# EAGLE schematic NTC_MUX8_board (EAGLE 9.6.2)
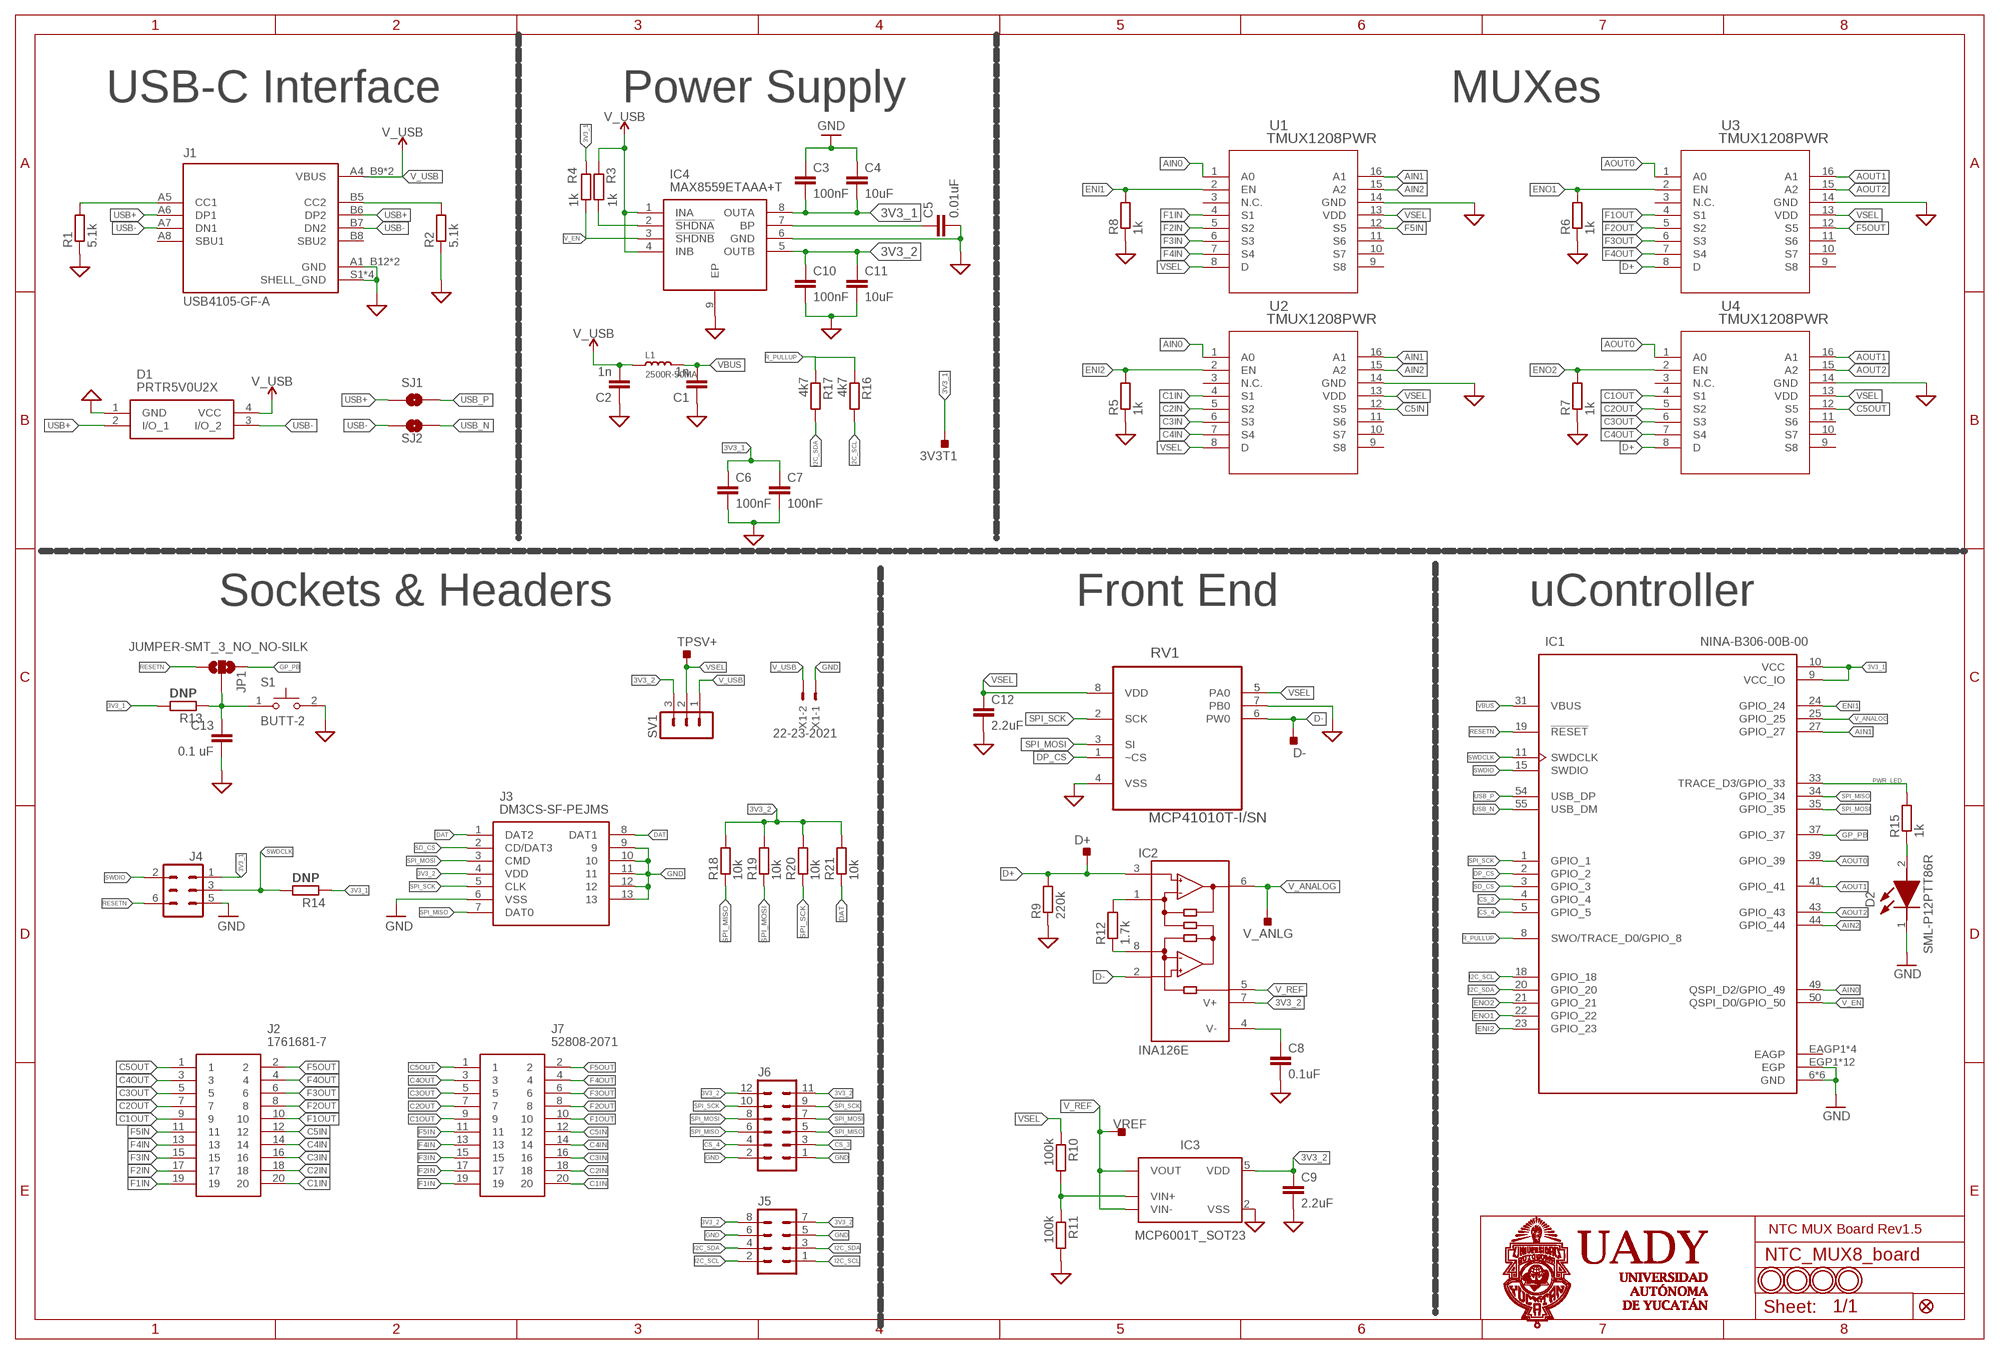
[diagram p0: schematic, sheet 1]

## Parts
3V3T1  TESTPOINT_TPS-SMD-10SN  [TESTPOINT_SMD-10SN]
C1  1n  C-EUC0603  [C0603]
C2  1n  C-EUC0603  [C0603]
C3  100nF  C-EUC0603  [C0603]
C4  10uF  C-EUC0603  [C0603]
C5  0.01uF  C-EUC0603  [C0603]
C6  100nF  C-EUC0603  [C0603]
C7  100nF  C-EUC0603  [C0603]
C8  0.1uF  C-EUC0603  [C0603]
C9  2.2uF  C-EUC0603  [C0603]
C10  100nF  C-EUC0603  [C0603]
C11  10uF  C-EUC0603  [C0603]
C12  2.2uF  C-EUC0603  [C0603]
C13  0.1 uF  C-EUC0603  [C0603]
D1  PRTR5V0U2X  [PRTR5V0U2X]
D2  SML-P12PTT86R  [LEDC1006X25N]
D+  TESTPOINT_TPS-SMD-10SN  [TESTPOINT_SMD-10SN]
D-  TESTPOINT_TPS-SMD-10SN  [TESTPOINT_SMD-10SN]
FID1  FIDUCIAL_1MM  [FIDUCIAL_1MM]
IC1  NINA-B306-00B-00  [XCVR_NINA-B306-00B-00]
IC2  INA126E  [MSOP08]
IC3  MCP6001T_SOT23  [SOT95P280X145-5N]
IC4  MAX8559ETAAA+T  [SON65P300X300X80-9N]
J1  USB4105-GF-A  [GCT_USB4105-GF-A]
J2  1761681-7  [SHDR20W66P254_2X10_3302X883X92]
J3  DM3CS-SF-PEJMS  [DM3CSSFPEJMS]
J4  DNP  PINHD-2X03(NO4)  [2X03-TP1]
J5  MA04-2  [MA04-2]
J6  MA06-2  [MA06-2]
J7  52808-2071  [528082071]
JP1  JUMPER-SMT_3_NO_NO-SILK  [SMT-JUMPER_3_NO_NO-SILK]
L1  2500R-50MA  SMD-FERRITE-BEAD-2500R-50MA(0603)  [L0603]
R1  5.1k  R-EU_R0603  [R0603]
R2  5.1k  R-EU_R0603  [R0603]
R3  1k  R-EU_R0603  [R0603]
R4  1k  R-EU_R0603  [R0603]
R5  1k  R-EU_R0603  [R0603]
R6  1k  R-EU_R0603  [R0603]
R7  1k  R-EU_R0603  [R0603]
R8  1k  R-EU_R0603  [R0603]
R9  220k  R-EU_R0603  [R0603]
R10  100k  R-EU_R0603  [R0603]
R11  100k  R-EU_R0603  [R0603]
R12  1.7k  R-EU_R0603  [R0603]
R13  DNP  R-EU_R0603  [R0603]
R14  DNP  R-EU_R0603  [R0603]
R15  1k  R-EU_R0603  [R0603]
R16  4k7  R-EU_R0603  [R0603]
R17  4k7  R-EU_R0603  [R0603]
R18  10k  R-EU_R0603  [R0603]
R19  10k  R-EU_R0603  [R0603]
R20  10k  R-EU_R0603  [R0603]
R21  10k  R-EU_R0603  [R0603]
RV1  MCP41010T-I/SN  [SOIC127P600X175-8N]
S1  BUTT-2  [SW_BUTT-2]
SJ1  JUMPER-SMT_2_NO_NO-SILK  [SMT-JUMPER_2_NO_NO-SILK]
SJ2  JUMPER-SMT_2_NO_NO-SILK  [SMT-JUMPER_2_NO_NO-SILK]
SV1  MA03-1  [MA03-1]
TPSV+  TESTPOINT_TPS-SMD-10SN  [TESTPOINT_SMD-10SN]
U1  TMUX1208PWR  [PW_16_TEX]
U2  TMUX1208PWR  [PW_16_TEX]
U3  TMUX1208PWR  [PW_16_TEX]
U4  TMUX1208PWR  [PW_16_TEX]
U$2  MOUNTINGHOLE2.5  [MOUNTINGHOLE_2.5_PLATED]
U$3  MOUNTINGHOLE2.5  [MOUNTINGHOLE_2.5_PLATED]
U$4  MOUNTINGHOLE2.5  [MOUNTINGHOLE_2.5_PLATED]
U$24  MOUNTINGHOLE2.5  [MOUNTINGHOLE_2.5_PLATED]
V_ANLG  TESTPOINT_TPS-SMD-10SN  [TESTPOINT_SMD-10SN]
VREF  TESTPOINT_TPS-SMD-10SN  [TESTPOINT_SMD-10SN]
X1  22-23-2021  [22-23-2021]

## Nets
3V3_1: 3V3T1.TP C3.2 C4.2 C6.1 C7.1 IC1.9(VCC_IO) IC1.10(VCC) IC4.8(OUTA) J4.1 R4.1 R13.2 R14.1
3V3_2: C9.1 C10.1 C11.1 IC2.7(V+) IC3.5(VDD) IC4.5(OUTB) J3.4(VDD) J5.7 J5.8 J6.11 J6.12 R18.2 R19.2 R20.2 R21.2 SV1.3
AIN0: IC1.49(QSPI_D2/GPIO_49) U1.1(A0) U2.1(A0)
AIN1: IC1.27(GPIO_27) U1.16(A1) U2.16(A1)
AIN2: IC1.44(GPIO_44) U1.15(A2) U2.15(A2)
AOUT0: IC1.39(GPIO_39) U3.1(A0) U4.1(A0)
AOUT1: IC1.41(GPIO_41) U3.16(A1) U4.16(A1)
AOUT2: IC1.43(GPIO_43) U3.15(A2) U4.15(A2)
C1IN: J2.20 J7.20 U2.4(S1)
C1OUT: J2.9 J7.9 U4.4(S1)
C2IN: J2.18 J7.18 U2.5(S2)
C2OUT: J2.7 J7.7 U4.5(S2)
C3IN: J2.16 J7.16 U2.6(S3)
C3OUT: J2.5 J7.5 U4.6(S3)
C4IN: J2.14 J7.14 U2.7(S4)
C4OUT: J2.3 J7.3 U4.7(S4)
C5IN: J2.12 J7.12 U2.12(S5)
C5OUT: J2.1 J7.1 U4.12(S5)
CS_3: IC1.4(GPIO_4) J6.3
CS_4: IC1.5(GPIO_5) J6.4
D+: D+.TP IC2.3(+IN) R9.2 U3.8(D) U4.8(D)
D-: D-.TP IC2.2(-IN) RV1.6(PW0)
DAT: J3.1(DAT2) J3.8(DAT1) R21.1
DP_CS: IC1.2(GPIO_2) RV1.1(~CS)
ENI1: IC1.24(GPIO_24) R8.2 U1.2(EN)
ENI2: IC1.23(GPIO_23) R5.2 U2.2(EN)
ENO1: IC1.22(GPIO_22) R6.2 U3.2(EN)
ENO2: IC1.21(GPIO_21) R7.2 U4.2(EN)
F1IN: J2.19 J7.19 U1.4(S1)
F1OUT: J2.10 J7.10 U3.4(S1)
F2IN: J2.17 J7.17 U1.5(S2)
F2OUT: J2.8 J7.8 U3.5(S2)
F3IN: J2.15 J7.15 U1.6(S3)
F3OUT: J2.6 J7.6 U3.6(S3)
F4IN: J2.13 J7.13 U1.7(S4)
F4OUT: J2.4 J7.4 U3.7(S4)
F5IN: J2.11 J7.11 U1.12(S5)
F5OUT: J2.2 J7.2 U3.12(S5)
GND: C1.1 C2.1 C3.1 C4.1 C5.2 C6.2 C7.2 C8.2 C9.2 C10.2 C11.2 C12.2 C13.2 D1.1(GND) D2.1(K) IC1.6(GND) IC1.12(GND) IC1.14(GND) IC1.26(GND) IC1.30(GND) IC1.53(GND) IC1.EGP1(EGP) IC1.EGP2(EGP) IC1.EGP3(EGP) IC1.EGP4(EGP) IC1.EGP5(EGP) IC1.EGP6(EGP) IC1.EGP7(EGP) IC1.EGP8(EGP) IC1.EGP9(EGP) IC1.EGP10(EGP) IC1.EGP11(EGP) IC1.EGP12(EGP) IC3.2(VSS) IC4.6(GND) IC4.9(EP) J1.A1_B12(GND) J1.B1_A12(GND) J1.S1(SHELL_GND) J1.S2(SHELL_GND) J1.S3(SHELL_GND) J1.S4(SHELL_GND) J3.6(VSS) J3.9 J3.10 J3.11 J3.12 J3.13 J4.5 J5.5 J5.6 J6.1 J6.2 R1.1 R2.1 R5.1 R6.1 R7.1 R8.1 R9.1 R11.2 RV1.4(VSS) RV1.7(PB0) S1.2 U1.14(GND) U2.14(GND) U3.14(GND) U4.14(GND) X1.1 ; supply symbol labelled SUP
GP_PB: IC1.37(GPIO_37) JP1.3
I2C_SCL: IC1.18(GPIO_18) J5.1 J5.2 R16.2
I2C_SDA: IC1.20(GPIO_20) J5.3 J5.4 R17.2
N$1: J1.A5(CC1) R1.2
N$2: IC4.2(!SHDNA) R3.2
N$3: D2.2(A) R15.1
N$4: IC2.1(RG) R12.2
N$5: C5.1 IC4.7(BP)
N$6: IC2.8(RG) R12.1
N$7: C8.1 IC2.4(V-)
N$8: J1.B5(CC2) R2.2
N$9: IC3.3(VIN+) R10.2 R11.1
PWR_LED: IC1.33(TRACE_D3/GPIO_33) R15.2
R_PULLUP: IC1.8(SWO/TRACE_D0/GPIO_8) R16.1 R17.1
RESET: C13.1 JP1.2 R13.1 S1.1
RESETN: IC1.19(!RESET) J4.6 JP1.1
SD_CS: IC1.3(GPIO_3) J3.2(CD/DAT3)
SPI_MISO: IC1.34(GPIO_34) J3.7(DAT0) J6.5 J6.6 R18.1
SPI_MOSI: IC1.35(GPIO_35) J3.3(CMD) J6.7 J6.8 R19.1 RV1.3(SI)
SPI_SCK: IC1.1(GPIO_1) J3.5(CLK) J6.9 J6.10 R20.1 RV1.2(SCK)
SWDCLK: IC1.11(SWDCLK) J4.3 R14.2
SWDIO: IC1.15(SWDIO) J4.2
USB+: D1.2(I/O_1) J1.A6(DP1) J1.B6(DP2) SJ1.1
USB-: D1.3(I/O_2) J1.A7(DN1) J1.B7(DN2) SJ2.1
USB_N: IC1.55(USB_DM) SJ2.2
USB_P: IC1.54(USB_DP) SJ1.2
V_ANALOG: IC1.25(GPIO_25) IC2.6(OUT) V_ANLG.TP
V_EN: IC1.50(QSPI_D0/GPIO_50) IC4.3(!SHDNB) R4.2
V_REF: IC2.5(REF) IC3.1(VOUT) IC3.4(VIN-) VREF.TP
V_USB: C2.2 D1.4(VCC) IC4.1(INA) IC4.4(INB) J1.A4_B9(VBUS) J1.B4_A9(VBUS) L1.1 R3.1 SV1.1 X1.2
VBUS: C1.2 IC1.31(VBUS) L1.2
VSEL: C12.1 R10.1 RV1.5(PA0) RV1.8(VDD) SV1.2 TPSV+.TP U1.8(D) U1.13(VDD) U2.8(D) U2.13(VDD) U3.13(VDD) U4.13(VDD)
Unconnected: J1.A8(SBU1) J1.B8(SBU2) U1.3(N.C.) U1.9(S8) U1.10(S7) U1.11(S6) U2.3(N.C.) U2.9(S8) U2.10(S7) U2.11(S6) U3.3(N.C.) U3.9(S8) U3.10(S7) U3.11(S6) U4.3(N.C.) U4.9(S8) U4.10(S7) U4.11(S6)

## Notes on the sheet
- USB-C Interface | Power Supply | MUXes
- Sockets & Headers | Front End | uController
- NTC MUX Board Rev1.5

## Power pins joined to a net without a drawn wire
EAGP: IC1.EAGP1(EAGP) IC1.EAGP2(EAGP) IC1.EAGP3(EAGP) IC1.EAGP4(EAGP)

## Library data of the parts
3V3T1 D+ D- TPSV+ V_ANLG VREF = 52101-101-REV-A_v16:TESTPOINT_TPS: TEST POINT PAD; BOM: EXCLUDE
C1-C13 = rcl:C-EU: CAPACITOR, European symbol; SPICEPREFIX: C
D1 = PRTR5V0U2X:PRTR5V0U2X: NEXPERIA - PRTR5V0U2X - DIODE, TVS, DUAL, SOT-143B Source: Datasheet <https://assets.nexperia.com/documents/data-sheet/PRTR5V0U2X.pdf>; DESCRIPTION: NEXPERIA - PRTR5V0U2X - DIODE, TVS, DUAL, SOT-143B; HEIGHT: 1.1mm; MANUFACTURER_NAME: Nexperia; MANUFACTURER_PART_NUMBER: PRTR5V0U2X; MOUSER_PART_NUMBER: N/A; MOUSER_PRICE-STOCK: https://www.mouser.co.uk/ProductDetail/Nexperia/PRTR5V0U2X?qs=vHuUswq2%252BsxqVTVM0kNyWw%3D%3D
D2 = SML-P12PTT86R:SML-P12PTT86R: ROHM - SML-P12PTT86R - LED, PICOLED, Green, SMD, 1005, 20 mA, 2.2 V, 560 nm Source: Datasheet <https://componentsearchengine.com/Datasheets/2/SML-P12PTT86R.pdf>; DESCRIPTION: ROHM - SML-P12PTT86R - LED, PICOLED, Green, SMD, 1005, 20 mA, 2.2 V, 560 nm; HEIGHT: 0.25mm; MANUFACTURER_NAME: ROHM Semiconductor; MANUFACTURER_PART_NUMBER: SML-P12PTT86R; MOUSER_PART_NUMBER: 755-SML-P12PTT86R; MOUSER_PRICE-STOCK: https://www.mouser.co.uk/ProductDetail/ROHM-Semiconductor/SML-P12PTT86R?qs=Ei%2Fnxee9QYifz6HhDm1g1Q%3D%3D
FID1 = microbuilder:FIDUCIAL: Fiducial Alignment Points Various fiducial points for machine vision alignment.; BOM: EXCLUDE
IC1 = NINA-B306-00B-00:NINA-B306-00B-00: With internal PCB antenna, 10.0 x 15.0 x 2.2 mm, use with open CPU Check availability <https://pricing.snapeda.com/parts/NINA-B306-00B-00/U-Blox%20America%20Inc./view-part?ref=eda>; AVAILABILITY: In Stock; DESCRIPTION: With internal PCB antenna, 10.0 x 15.0 x 2.2 mm, use with open CPU; MF: U-Blox America Inc.; MP: NINA-B306-00B-00; PACKAGE: SMD-55 U-Blox; PRICE: None; PURCHASE-URL: https://pricing.snapeda.com/search/part/NINA-B306-00B-00/?ref=eda
IC2 = INA126:INA126: Instrumentation Amplifier Micropower, Single and Dual Versions Check availability <https://pricing.snapeda.com/parts/INA126/Texas%20Instruments/view-part?ref=eda>; AVAILABILITY: In Stock; DESCRIPTION: Instrumentation Amplifier 1 Circuit - 8-VSSOP; MF: Texas Instruments; MP: INA126; PACKAGE: - Texas Instruments; PRICE: None; PURCHASE-URL: https://pricing.snapeda.com/search/part/INA126/?ref=eda
IC3 = IC_Linear:MCP6001T: Low-Power Operational Amplifier Reference Datasheet <https://ww1.microchip.com/downloads/en/DeviceDoc/MCP6001-1R-1U-2-4-1-MHz-Low-Power-Op-Amp-DS20001733L.pdf>; CATEGORY: Amplifier; DESCRIPTION: Low-Power Operational Amplifier; MANUFACTURER: Microchip Technology; MPN: Generic; SERIES: MCP6001; SUB-CATEGORY: OpAmp
IC4 = MAX8559ETAAA+T:MAX8559ETAAA+T: LDO Voltage Regulators Dual 300mA Low-Noise Linear Regulator Source: Datasheet <https://datasheets.maximintegrated.com/en/ds/MAX8559.pdf>; ARROW_PART_NUMBER: MAX8559ETAAA+T; ARROW_PRICE-STOCK: https://www.arrow.com/en/products/max8559etaaat/maxim-integrated?region=nac; DESCRIPTION: LDO Voltage Regulators Dual 300mA Low-Noise Linear Regulator; HEIGHT: 0.8mm; MANUFACTURER_NAME: Maxim Integrated; MANUFACTURER_PART_NUMBER: MAX8559ETAAA+T; MOUSER_PART_NUMBER: 700-MAX8559ETAAAT; MOUSER_PRICE-STOCK: https://www.mouser.co.uk/ProductDetail/Maxim-Integrated/MAX8559ETAAA%2bT?qs=Jw2w9zrI6w82U2vO8NRcoQ%3D%3D
J1 = USB4105-GF-A:USB4105-GF-A: USB-C (USB TYPE-C) USB 2.0 Receptacle Connector 24 (16+8 Dummy) Position Surface Mount, Right Angle; Through Hole Check availability <https://pricing.snapeda.com/parts/USB4105-GF-A/GCT/view-part?ref=eda>; AVAILABILITY: In Stock; DESCRIPTION: USB-C (USB TYPE-C) USB 2.0 Receptacle Connector 24 (16+8 Dummy) Position Surface Mount, Right Angle; Through Hole; MF: GCT; MP: USB4105-GF-A; PACKAGE: None; PRICE: None; PURCHASE-URL: https://pricing.snapeda.com/search/part/USB4105-GF-A/?ref=eda
J2 = 1761681-7:1761681-7: 2.54mm,Header,vert,DR,20W,lo profile,Au Source: Datasheet <https://datasheet.datasheetarchive.com/originals/dk/DKDS-21/401441.pdf>; ARROW_PART_NUMBER: 1761681-7; ARROW_PRICE-STOCK: https://www.arrow.com/en/products/1761681-7/te-connectivity?region=nac; DESCRIPTION: 2.54mm,Header,vert,DR,20W,lo profile,Au; HEIGHT: 9.22mm; MANUFACTURER_NAME: TE Connectivity; MANUFACTURER_PART_NUMBER: 1761681-7; MOUSER_PART_NUMBER: 571-1761681-7; MOUSER_PRICE-STOCK: https://www.mouser.co.uk/ProductDetail/TE-Connectivity/1761681-7?qs=xbX7sCn4AeOgS8GR6bHZNw%3D%3D
J3 = DM3CS-SF-PEJMS:DM3CS-SF-PEJMS: Memory Card Connectors 8P R/A SMT MICRO SD HINGE PUSH-PULL Source: Datasheet; DESCRIPTION: Memory Card Connectors 8P R/A SMT MICRO SD HINGE PUSH-PULL; HEIGHT: 1.83mm; MANUFACTURER_NAME: Hirose; MANUFACTURER_PART_NUMBER: DM3CS-SF-PEJMS
J4 = Arduino-connectors:PINHD-2X03(NO4): PIN HEADER; CODE-ARDUINO: DNP; DATASHEET: DNP; DISTRIBUTOR-LINK: DNP; DISTRIBUTOR-PN: DNP; MANUFACTURER: DNP; MANUFACTURER-PN: DNP
J5 = con-lstb:MA04-2: PIN HEADER; OC_FARNELL: unknown; OC_NEWARK: unknown
J6 = con-lstb:MA06-2: PIN HEADER; OC_FARNELL: unknown; OC_NEWARK: unknown
J7 = 52808-2071:52808-2071: Molex FFC/FPC SMT Series 1mm Pitch 20 Way 1 Row Straight SMT Female FPC Connector, Tin over Nickel Plated Contacts Source: Datasheet <https://www.molex.com/pdm_docs/sd/528082071_sd.pdf>; DESCRIPTION: Molex FFC/FPC SMT Series 1mm Pitch 20 Way 1 Row Straight SMT Female FPC Connector, Tin over Nickel Plated Contacts; HEIGHT: 5.3mm; MANUFACTURER_NAME: Molex; MANUFACTURER_PART_NUMBER: 52808-2071; MOUSER_PART_NUMBER: 538-52808-2071; MOUSER_PRICE-STOCK: https://www.mouser.co.uk/ProductDetail/Molex/52808-2071?qs=%252BdbFUiYBkDbHBMqIAYlO1A%3D%3D
JP1 = SparkFun-Jumpers:JUMPER-SMT_3_NO: Normally open jumper This jumper has three pads in close proximity to each other. Apply solder to close the connection(s).
L1 = OPL_Ferrite_and_Magnetic_Bead:SMD-FERRITE-BEAD-2500R-50MA(0603): 303030020
R1-R21 = rcl:R-EU_: RESISTOR, European symbol; SPICEPREFIX: R
RV1 = MCP41010T-I_SN:MCP41010T-I/SN: Digital potentiometer Check availability <https://pricing.snapeda.com/parts/MCP41010T-I/SN/Microchip%20Technology/view-part?ref=eda>; AVAILABILITY: In Stock; DESCRIPTION: Digital Potentiometer 10k Ohm 1 Circuit 256 Taps SPI Interface 8-SOIC; MF: Microchip Technology; MP: MCP41010T-I/SN; PACKAGE: SOIC-8 Microchip; PRICE: None; PURCHASE-URL: https://pricing.snapeda.com/search/part/MCP41010T-I/SN/?ref=eda
S1 = BUTT-2:BUTT-2: Tactile Switches MINI PUSH BUTTON SWITCH 2-PIN QTY. 4 Check availability <https://pricing.snapeda.com/parts/BUTT-2/Gravitech/view-part?ref=eda>; AVAILABILITY: In Stock; DESCRIPTION: Tactile Switches MINI PUSH BUTTON SWITCH 2-PIN QTY. 4; MF: Gravitech; MP: BUTT-2; PACKAGE: None; PRICE: None; PURCHASE-URL: https://pricing.snapeda.com/search/part/BUTT-2/?ref=eda
SJ1 SJ2 = SparkFun-Jumpers:JUMPER-SMT_2_NO: Normally open jumper This jumper has two pads in close proximity to each other. Apply solder to close the connection. Round pads are easier to solder for beginners, but are a lot larger. SparkFun Product that uses the round pads: SparkFun EL Sequencer <https://www.sparkfun.com/products/12781>
SV1 = con-lstb:MA03-1: PIN HEADER; OC_FARNELL: unknown; OC_NEWARK: unknown
U1-U4 = TMUX1208:TMUX1208PWR; COPYRIGHT: Copyright (C) 2022 Ultra Librarian. All rights reserved.; MANUFACTURER_PART_NUMBER: TMUX1208PWR; MFR_NAME: Texas Instruments
U$2-U$4 U$24 = microbuilder:MOUNTINGHOLE: Mounting Hole For #2 screws (0.086"/2.18mm width, 0.094"/2.4mm hole) use 2.5mm
X1 = con-molex:22-23-2021: .100" (2.54mm) Center Header - 2 Pin; MF: MOLEX; MPN: 22-23-2021; OC_FARNELL: 1462926; OC_NEWARK: 25C3832